# EAGLE design 261105902xxxx-HW-V2.1_20230207 (EAGLE 7.7.0)
Assembly variants: Thetis-I, Setebos-I, Proteus-III
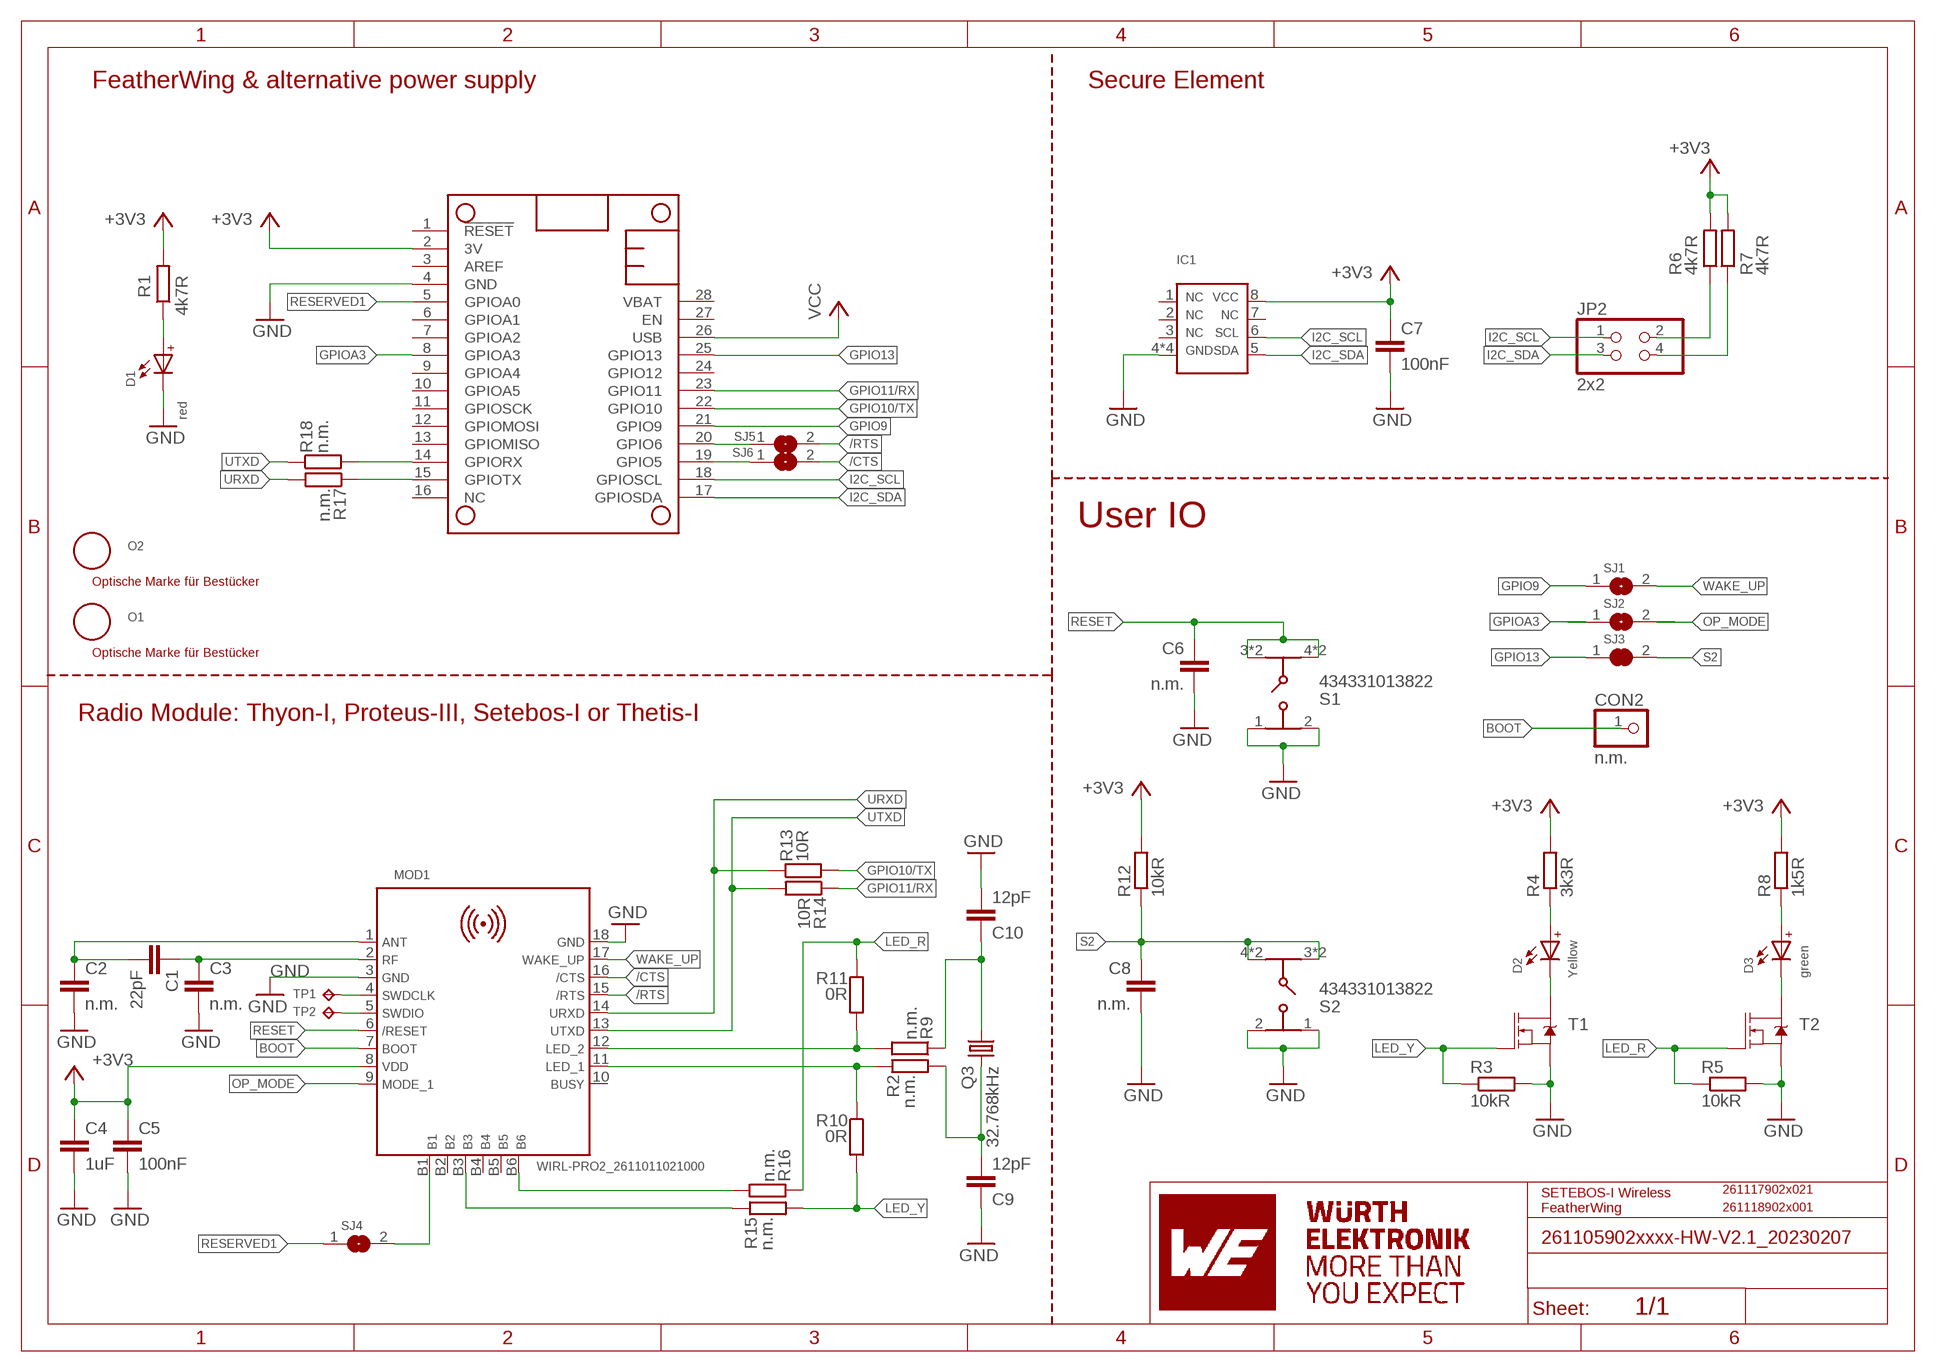
[diagram p0: schematic, sheet 1]

## Parts
C1  22pF  C22PF0402_IPC  [C0402_IPC]
C2  n.m.  C0402_IPC  [C0402_IPC]
C3  n.m.  C0402_IPC  [C0402_IPC]
C4  1uF  C1UF0402_IPC  [C0402_IPC]
C5  100nF  C100NF0402_IPC  [C0402_IPC]
C6  n.m.  C0402_IPC  [C0402_IPC]
C7  100nF  C100NF0402_IPC  [C0402_IPC]  (not fitted in variant Proteus-III)
C8  n.m.  C0402_IPC  [C0402_IPC]
C9  12pF  C12PF0402_IPC  [C0402_IPC]  (not fitted in variant Setebos-I)  (not fitted in variant Proteus-III)
C10  12pF  C12PF0402_IPC  [C0402_IPC]  (not fitted in variant Setebos-I)  (not fitted in variant Proteus-III)
CON2  n.m.  PINHD-1X1/R  [1X01/R]
D1  red  WL-SMSW_1204_155124VS73200  [WL-SMSW_1204_A]
D2  Yellow  WL-SMSW_1204_155124YS73200  [WL-SMSW_1204_A]
D3  green  WL-SMSW_1204_155124VS73200  [WL-SMSW_1204_A]
IC1  ATECC608B  ATECC608B-TNGTLS  [UDFN-8]  (not fitted in variant Proteus-III)
JP2  2x2  PINHD-2X2  [2X02]
MOD1  WIRL-PRO2_2611011021000  [WIRL-PRO2_2611011021000]
MS1  header: 1 x 12 & 1 x 16  FEATHERWING  [FEATHERWING]
O1  n.m.  OPT_MARKE  [OPTISCHE_MARKE]
O2  n.m.  OPT_MARKE  [OPTISCHE_MARKE]
Q3  32.768kHz  3216  [3216]  (not fitted in variant Setebos-I)  (not fitted in variant Proteus-III)
R1  4k7R  R4K70402_IPC  [R0402_IPC]
R2  n.m.  R0402_IPC  [R0402_IPC]  (not fitted in variant Setebos-I)  (variant Thetis-I: 0R)  (not fitted in variant Proteus-III)
R3  10kR  R10KR0402_IPC  [R0402_IPC]
R4  3k3R  R3K3R0402_IPC  [R0402_IPC]
R5  10kR  R10KR0402_IPC  [R0402_IPC]
R6  4k7R  R4K70402_IPC  [R0402_IPC]
R7  4k7R  R4K70402_IPC  [R0402_IPC]
R8  1k5R  R1K5R0402_IPC  [R0402_IPC]
R9  n.m.  R0402_IPC  [R0402_IPC]  (not fitted in variant Setebos-I)  (variant Thetis-I: 0R)  (not fitted in variant Proteus-III)
R10  0R  R0R0402_IPC  [R0402_IPC]  (not fitted in variant Thetis-I)
R11  0R  R0R0402_IPC  [R0402_IPC]  (not fitted in variant Thetis-I)
R12  10kR  R10KR0402_IPC  [R0402_IPC]
R13  10R  R10R0402_IPC  [R0402_IPC]
R14  10R  R10R0402_IPC  [R0402_IPC]
R15  n.m.  R0402_IPC  [R0402_IPC]  (variant Thetis-I: 0R)  (not fitted in variant Setebos-I)  (not fitted in variant Proteus-III)
R16  n.m.  R0402_IPC  [R0402_IPC]  (variant Thetis-I: 0R)  (not fitted in variant Setebos-I)  (not fitted in variant Proteus-III)
R17  n.m.  R0402_IPC  [R0402_IPC]
R18  n.m.  R0402_IPC  [R0402_IPC]
S1  434331013822  [434331013822]
S2  434331013822  [434331013822]
SJ1  SJ  [SJ]
SJ2  SJ  [SJ]
SJ3  SJ_SHUNTD  [SJ_D]
SJ4  SJ  [SJ]
SJ5  SJ  [SJ]
SJ6  SJ  [SJ]
T1  MOSFET-NCH-BSS138  [SOT23-3]
T2  MOSFET-NCH-BSS138  [SOT23-3]
TP1  TP15R  [TP15R]
TP2  TP15R  [TP15R]

## Nets
+3V3: C4.1 C5.1 C7.1 IC1.8(VCC) MOD1.8(VDD) MS1.2(3V) R1.2 R4.2 R6.2 R7.2 R8.2 R12.2
/CTS: MOD1.16(P0.12/!CTS) SJ6.2
/RTS: MOD1.15(P0.11/!RTS) SJ5.2
ANT: C1.2 C2.1 MOD1.1(ANT_PAD)
BOOT: CON2.1 MOD1.7(P0.02/BOOT)
GND: C2.2 C3.2 C4.2 C5.2 C6.2 C7.2 C8.2 C9.1 C10.2 D1.1(-) IC1.4(GND) IC1.P$1(GND) IC1.P$2(GND) IC1.THERMAL_PAD(GND) MOD1.3(GND) MOD1.18(GND) MS1.4(GND) R3.2 R5.2 S1.1 S1.2 S2.1 S2.2 T1.2(S) T2.2(S)
GPIO9: MS1.21(GPIO9) SJ1.1
GPIO10/TX: MS1.22(GPIO10) R13.2
GPIO11/RX: MS1.23(GPIO11) R14.1
GPIO13: MS1.25(GPIO13) SJ3.1
GPIOA3: MS1.8(GPIOA3) SJ2.1
I2C_SCL: IC1.6(SCL) JP2.1 MS1.18(GPIOSCL)
I2C_SDA: IC1.5(SDA) JP2.3 MS1.17(GPIOSDA)
LED_R: R5.1 R11.1 R16.1 T2.1(G)
LED_Y: R3.1 R10.2 R15.2 T1.1(G)
N$1: D1.2(+) R1.1
N$2: D2.2(+) R4.1
N$3: D2.1(-) T1.3(D)
N$4: D3.2(+) R8.1
N$5: D3.1(-) T2.3(D)
N$6: JP2.2 R6.1
N$7: JP2.4 R7.1
N$8: MOD1.B1 SJ4.2
N$9: MOD1.12(P0.01/LED_2) R9.2 R11.2
N$10: MOD1.11(P0.00/LED_1) R2.1 R10.1
N$11: C9.2 Q3.2 R2.2
N$12: C10.1 Q3.1 R9.1
N$13: MS1.20(GPIO6) SJ5.1
N$14: MS1.19(GPIO5) SJ6.1
N$15: MOD1.B3 R15.1
N$16: MOD1.B6 R16.2
N$17: MS1.14(GPIORX) R18.2
N$18: MS1.15(GPIOTX) R17.1
OP_MODE: MOD1.9(P0.19/MODE_1) SJ2.2
RESERVED1: MS1.5(GPIOA0) SJ4.1
RESET: C6.1 MOD1.6(P0.18/RESET) S1.3 S1.4 S1.5 S1.6
RF: C1.1 C3.1 MOD1.2(RF)
S2: C8.1 R12.1 S2.3 S2.4 S2.5 S2.6 SJ3.2
SWDCLK: MOD1.4(SWDCLK) TP1.P$1(TP)
SWDIO: MOD1.5(SWDIO) TP2.P$1(TP)
URXD: MOD1.14(P1.09/URXD) R13.1 R17.2
UTXD: MOD1.13(P1.08/UTXD) R14.2 R18.1
VCC: MS1.26(USB)
WAKE_UP: MOD1.17(P0.03/WAKE_UP) SJ1.2
Unconnected: IC1.1(NC1) IC1.2(NC2) IC1.3(NC3) IC1.7(NC4) MOD1.10(P0.22/BUSY) MOD1.B2 MOD1.B4 MOD1.B5 MS1.1(!RESET) MS1.3(AREF) MS1.6(GPIOA1) MS1.7(GPIOA2) MS1.9(GPIOA4) MS1.10(GPIOA5) MS1.11(GPIOSCK) MS1.12(GPIOMOSI) MS1.13(GPIOMISO) MS1.16(NC) MS1.24(GPIO12) MS1.27(EN) MS1.28(VBAT)

## Notes on the sheet
- FeatherWing & alternative power supply | Secure Element
- User IO
- Radio Module: Thyon-I, Proteus-III, Setebos-I or Thetis-I
- 261117902x021
- 261118902x001
- SETEBOS-I Wireless 
  FeatherWing

## Library data of the parts
C1 = rcl-WE:C; HEIGHT: 0.5mm; MANUFACTURER: Würth Elektronik; NR: 885012005057; PACK: 0402; SPG: 50V; TOL: 5%
C2 C3 C6 C8 = rcl-WE:C; HEIGHT: 0.5mm; MANUFACTURER: Würth Elektronik; PACK: 0402
C4 = rcl-WE:C; HEIGHT: 0.5mm; MANUFACTURER: Würth Elektronik; NR: 885012105012; PACK: 0402; SPG: 10V; TOL: 20%
C5 C7 = rcl-WE:C; HEIGHT: 0.5mm; MANUFACTURER: Würth Elektronik; NR: 885012205037; PACK: 0402; SPG: 16V; TOL: 10%
C9 C10 = rcl-amber:C; HEIGHT: 0.5mm; MANUFACTURER: Yageo; MAT: COG; NR: CC0402JRNP09BN120; PACK: 0402; SPG: 50V; TOL: 5%
CON2 = pinhead:PINHD-1X1: PIN HEADER
D1 = 155124VS73200_Eagle_WL-SMSW_rev19a:WL-SMSW_1204: SMD Side view mono-color round Characteristics Low power consumption High reliability Low current requirement No UV/IR radiation Wide viewing angle Excelllent for edge lighting displays and backlighting indicators Ideal for miniature applications PBC high-usage Compatible with automatic placement equipment Applications Backlighting for LCD Sidelighting applications Indicator and backlighting for telecommunication Backlighting for symbol, switch and dashboard General use <http://katalog.we-online.de/media/images/v2/Family_WL-SMSW(2).jpg> Details see: http://katalog.we-online.de/en/led/WL-SMSW?m Updated: 2015-04-10 2015 (C) Wurth Elektronik; HEIGHT: 1.5mm; MANUFACTURER: Würth Elektronik; NR: 155124RS73200; PACK: 1204
D2 = 155124VS73200_Eagle_WL-SMSW_rev19a:WL-SMSW_1204: SMD Side view mono-color round Characteristics Low power consumption High reliability Low current requirement No UV/IR radiation Wide viewing angle Excelllent for edge lighting displays and backlighting indicators Ideal for miniature applications PBC high-usage Compatible with automatic placement equipment Applications Backlighting for LCD Sidelighting applications Indicator and backlighting for telecommunication Backlighting for symbol, switch and dashboard General use <http://katalog.we-online.de/media/images/v2/Family_WL-SMSW(2).jpg> Details see: http://katalog.we-online.de/en/led/WL-SMSW?m Updated: 2015-04-10 2015 (C) Wurth Elektronik; HEIGHT: 1.5mm; MANUFACTURER: Würth Elektronik; NR: 155124YS73200; PACK: 1204
D3 = 155124VS73200_Eagle_WL-SMSW_rev19a:WL-SMSW_1204: SMD Side view mono-color round Characteristics Low power consumption High reliability Low current requirement No UV/IR radiation Wide viewing angle Excelllent for edge lighting displays and backlighting indicators Ideal for miniature applications PBC high-usage Compatible with automatic placement equipment Applications Backlighting for LCD Sidelighting applications Indicator and backlighting for telecommunication Backlighting for symbol, switch and dashboard General use <http://katalog.we-online.de/media/images/v2/Family_WL-SMSW(2).jpg> Details see: http://katalog.we-online.de/en/led/WL-SMSW?m Updated: 2015-04-10 2015 (C) Wurth Elektronik; HEIGHT: 1.5mm; MANUFACTURER: Würth Elektronik; NR: 155124VS73200; PACK: 1204
IC1 = microchip:ATECC608B-TNGTLS: CryptoAuthentication - Trust&GO secure element; HEIGHT: 0.55mm; MANUFACTURER: microchip; NR: ATECC608B-TNGTLSU; PACK: UDFN-8
JP2 = pinhead:PINHD-2X2: PIN HEADER; HEIGHT: 8.54mm; MANUFACTURER: Würth Elektronik; NR: 61300421121
MOD1 = WE_WIRL_Rev2:WIRL-PRO2_2611011021000: Thyone-I - Radio Modules 2.4 GHz WIRL-PRO2 Radio module 2.4 GHz T&R Details see: https://katalog.we-online.com/en/wco/WIRL-PRO2; HEIGHT: 2mm; MANUFACTURER: Würth Elektronik; NR: 2611011021000
MS1 = adafruit:FEATHERWING; COMMENT: Kit containing 2 headers; MANUFACTURER: Adafruit; NR: 2830
O1 O2 = testpad:OPT_MARKE: Gemäß Vorgabe MEC
Q3 = crystal:3216; HEIGHT: 0.9mm; MANUFACTURER: Würth Elektronik; MANUFACTURER_2: Microcrystal; NR: 830009706; NR_2: CM7V-T1A-32.768k-9pF-20PPM-TA-QA T3
R1 R6 R7 = rcl-amber:R; HEIGHT: 0.35mm; MANUFACTURER: Yageo; NR: RC0402FR-074K7L; P: 0.063W; PACK: 0402; TOL: 1%
R2 R9 R15-R18 = rcl-amber:R; HEIGHT: 0.35mm; MANUFACTURER: Yageo; PACK: 0402
R3 R5 R12 = rcl-amber:R; HEIGHT: 0.35mm; MANUFACTURER: Yageo; NR: RC0402FR-0710KL; PACK: 0402; TOL: 1%
R4 = rcl-amber:R; HEIGHT: 0.35; MANUFACTURER: Yageo; NR: RC0402FR-073K3L; P: 0.063W; PACK: 0402; TOL: 1%
R8 = rcl-amber:R; HEIGHT: 0.35mm; MANUFACTURER: Yageo; NR: RC0402FR-071K5L; PACK: 0402; TOL: 1%
R10 R11 = rcl-amber:R; HEIGHT: 0.35mm; MANUFACTURER: Yageo; NR: RC0402FR-070RL; PACK: 0402; TOL: 5%
R13 R14 = rcl-amber:R; HEIGHT: 0.35mm; MANUFACTURER: Yageo; NR: RC0402FR-0710RL; P: 0.063W; PACK: 0402; TOL: 1%
S1 S2 = 434331013822_Eagle_WS-TASU_rev19b:434331013822: WS-TASU Side push Tact Switch, SMD version Specification Rating : 50mA, 12VDC Contact Resistance Initial: 100mΩ max. After life test:1mΩ max. Insulation Resistance: min.100MΩ at 500VDC Dielectric Strength : 250VAC for 1 minute Stroke:0.2+0.2/-0.1mm Bounce :10ms max. Material Cover : : Stainless steel Stem :PA46 UL HB. FramePA46 UL HB, color Black >Contact : Stainless Steel with Silver Tape:Polyimide tape Terminal : Copper Alloy with Silver <http://katalog.we-online.de/media/images/v2/Family_WS-TASU_434331013822_c.jpg> Details see: http://katalog.we-online.de/en/em/TASU_3_5X2_9_SMD_SIDE_PUSH/434331013822 2015 (C) Würth Elektronik; HEIGHT: 1.35mm; MANUFACTURER: Würth Elektronik; NR: 434331013822
SJ1 SJ2 SJ4-SJ6 = jumper:SJ: SMD solder JUMPER
SJ3 = jumper:SJ_SHUNT: SMD solder JUMPER
T1 T2 = SparkFun-DiscreteSemi:MOSFET-NCH: N-channel MOSFETs Voltage controlled devices that allow control of high current outputs. SparkFun Products: SparkFun OpenScale <https://www.sparkfun.com/products/13261> SparkFun Digital Sandbox <https://www.sparkfun.com/products/12651> SparkFun Monster Moto Shield <https://www.sparkfun.com/products/10182> SparkFun MOSFET Power Controller <https://www.sparkfun.com/products/11214>; COMMENT: 220mA/50V/3.5O; HEIGHT: 1mm; MANUFACTURER: Diodes Incorporated; NR: BSS138-13-F
TP1 TP2 = testpad:TP15R

## Board
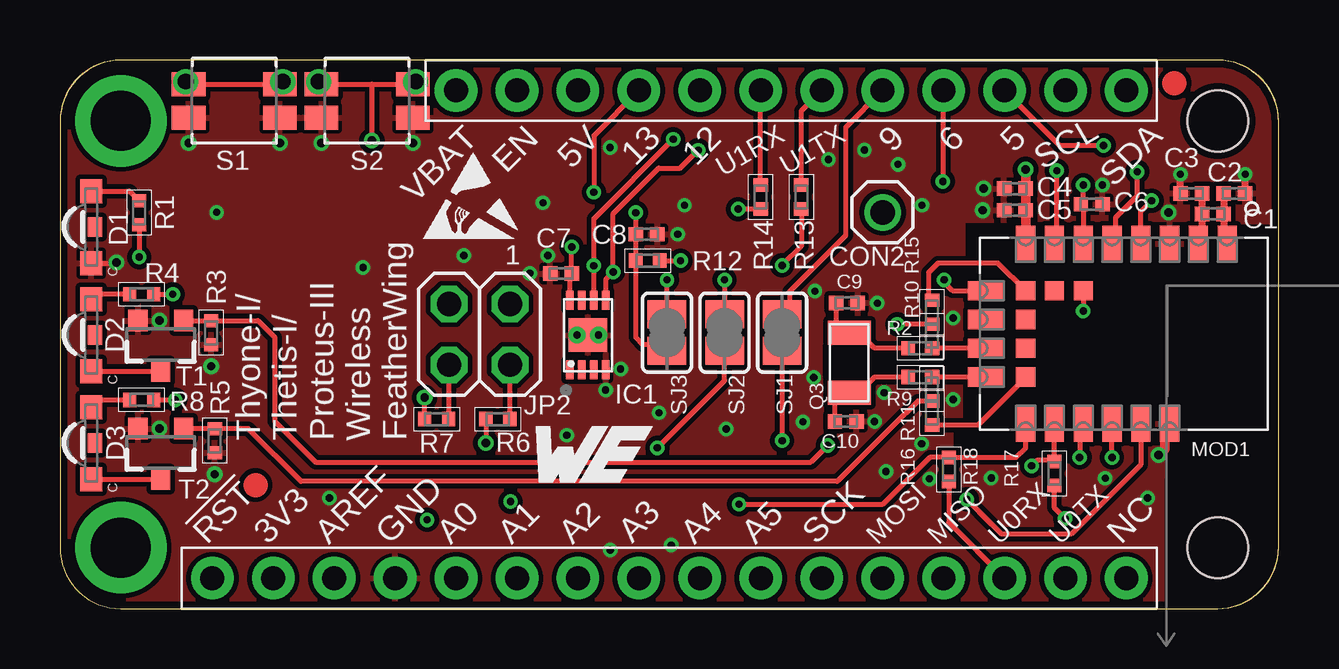
[diagram p1: board, top side]
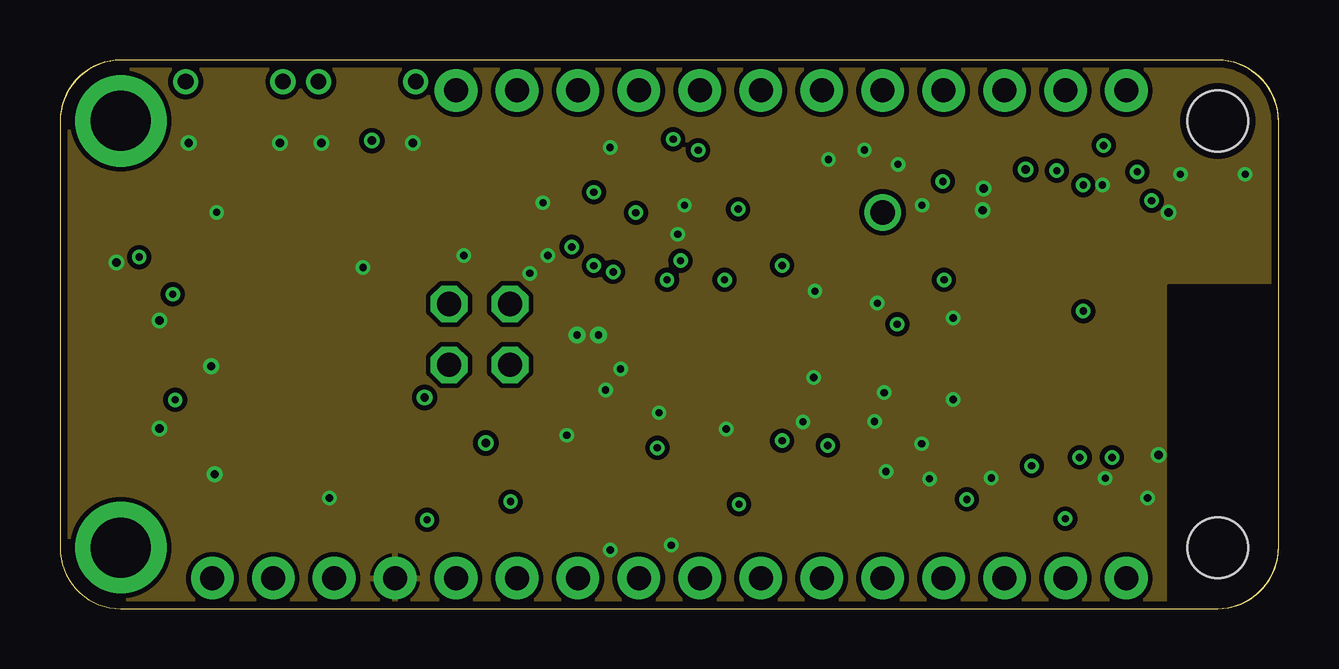
[diagram p2: board, inner layer Route2]
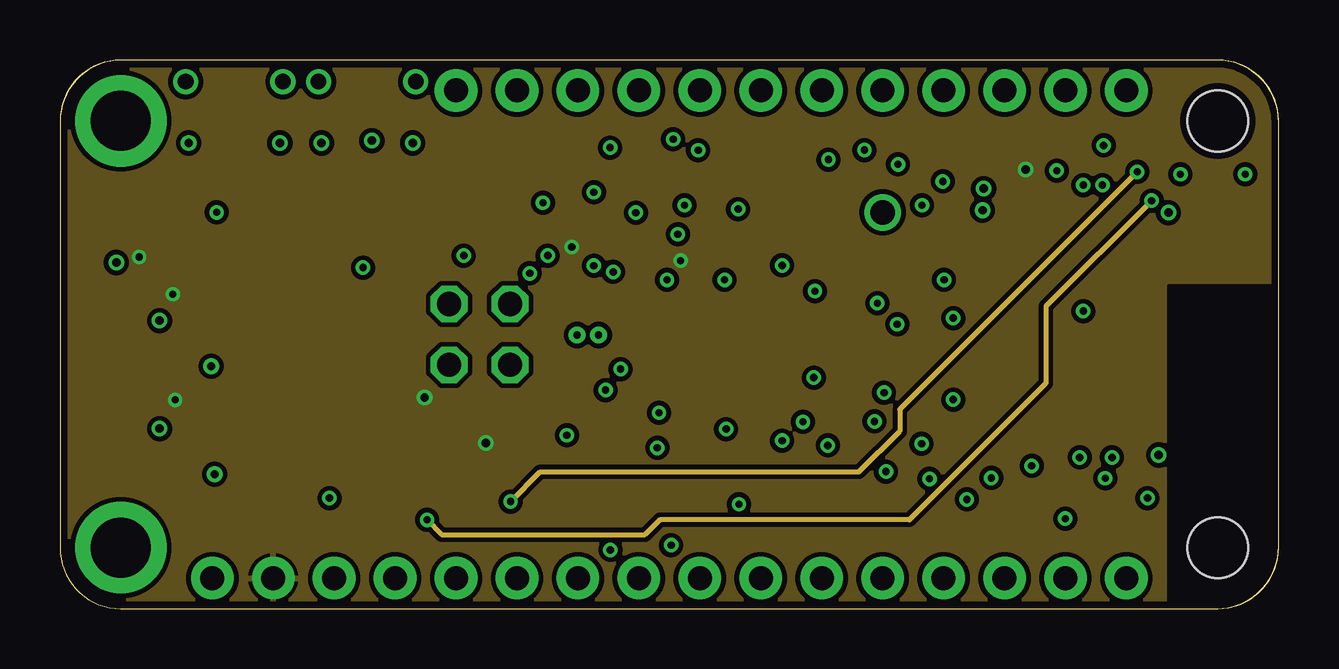
[diagram p3: board, inner layer Route15]
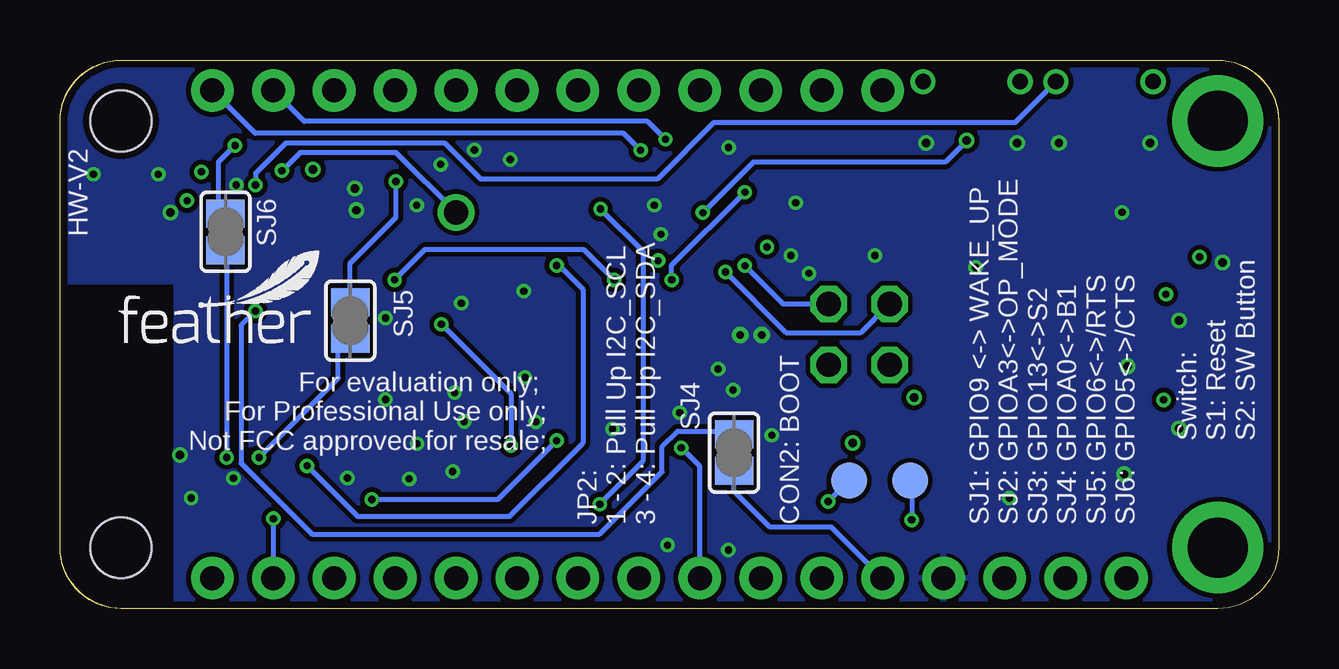
[diagram p4: board, bottom side, seen from below]

Size 50.8 x 22.86 mm. Coordinates in mm from the lower left corner, seen from the top.
Outline: 0,2.54 arc90 2.54,0 48.2,0 arc90 50.8,2.6 50.8,20.26 arc90 48.2,22.86
Outline: 2.59,22.86 arc90 0,20.27
Copper layers (1+2*15+16): Top 0.035mm / dielectric 0.412mm / Route2 0.035mm / dielectric 0.71mm / Route15 0.035mm / dielectric 0.412mm / Bottom 0.035mm
Design rules "default *": minimum track width 0.2mm, minimum drill 0.3mm, track to track 0.2mm, track to pad 0.2mm, pad to pad 0.2mm, via to via 0.2mm, smd to smd 0.2mm, copper to edge 0.3mm, drill to drill 6mil, minimum pad ring 0.2mm, minimum via ring 0.15mm, stop-mask expansion 0.05mm, vias tented up to drill 20mil, thermal gap 6mil
tRestrict: area 49.1,15.5 to 50.5,16; area 37.8,11.2 to 37.8,12.8; area 37.8,10.1 to 37.8,10.4; area 46,14.2 to 46.5,14.4; area 40.5,6.8 to 41.1,6.9; area 45.4,6.8 to 45.8,6.9; area 37.6,7.9 to 37.9,9.2; area 37.2,6.8 to 39.2,7.5; area 37.8,14.6 to 39.7,16.1; area 43,16 to 43.6,16.1; area 44.2,16 to 44.8,16.1; area 45.2,16 to 45.8,16.1; 5 more areas

### Footprints (pad centres in the part's own frame; a part is rotated, then mirrored left to right if it is on the bottom)
C0402_IPC = smd 0.6 x 0.6: 1 -0.45,0; 2 0.45,0
1X01/R = drill 1.016: 1 0,0
WL-SMSW_1204_A = smd 1 x 0.9: 1 -1.5,0; 2 1.5,0 | smd 0.8 x 0.6: 3 0,-0.15
UDFN-8 = smd 0.3 x 0.8: 1 -0.75,-1.45; 2 -0.25,-1.45; 3 0.25,-1.45; 4 0.75,-1.45; 5 0.75,1.45; 6 0.25,1.45; 7 -0.25,1.45; 8 -0.75,1.45 | drill 0.3 pad 0.7: P$1 -0.45,0; P$2 0.45,0 | smd 1.6 x 1.4: THERMAL_PAD 0,0
2X02 = drill 1.016 octagon: 1 -1.27,-1.27; 2 -1.27,1.27; 3 1.27,-1.27; 4 1.27,1.27
WIRL-PRO2_2611011021000 = smd 0.8 x 1.5: 1 -4.3,-3.75; 2 -3.1,-3.75; 3 -1.9,-3.75; 4 -0.7,-3.75; 5 0.5,-3.75; 6 1.7,-3.75; 7 2.9,-3.75; 8 4.1,-3.75; 13 4.1,3.75; 14 2.9,3.75; 15 1.7,3.75; 16 0.5,3.75; 17 -0.7,3.75; 18 -1.9,3.75 | smd 1.5 x 0.8: 9 5.75,-1.8; 10 5.75,-0.6; 11 5.75,0.6; 12 5.75,1.8 | smd 0.8 x 0.8: B1 1.7,-1.8; B2 2.9,-1.8; B3 4.1,-1.8; B4 4.1,-0.6; B5 4.1,0.6; B6 4.1,1.8
FEATHERWING = drill 1 pad 1.778: 1 6.35,1.27; 2 8.89,1.27; 3 11.43,1.27; 4 13.97,1.27; 5 16.51,1.27; 6 19.05,1.27; 7 21.59,1.27; 8 24.13,1.27; 9 26.67,1.27; 10 29.21,1.27; 11 31.75,1.27; 12 34.29,1.27; 13 36.83,1.27; 14 39.37,1.27; 15 41.91,1.27; 16 44.45,1.27; 17 44.45,21.59; 18 41.91,21.59; 19 39.37,21.59; 20 36.83,21.59; 21 34.29,21.59; 22 31.75,21.59; 23 29.21,21.59; 24 26.67,21.59; 25 24.13,21.59; 26 21.59,21.59; 27 19.05,21.59; 28 16.51,21.59 | drill 2.5 pad 3.81: P$1 2.54,20.32; P$2 2.54,2.54 | hole 2.54: 48.26,20.32; 48.26,2.54
3216 = smd 1 x 1.8: 1 1.25,0; 2 -1.25,0
R0402_IPC = smd 0.55 x 0.6: 1 -0.5,0; 2 0.5,0
434331013822 = smd 1.4 x 1: 1 -1.9,0.7; 2 1.9,0.7; 3 1.9,-0.7; 4 -1.9,-0.7 | drill 0.65 pad 0.78: 5 -2.025,-0.8; 6 2.025,-0.8
SJ = smd 1.168 x 1.6: 1 -0.762,0; 2 0.762,0
SJ_D = smd 1.168 x 1.6: 1 -0.762,0; 2 0.762,0
SOT23-3 = smd 0.8 x 0.9: 1 -0.95,-1; 2 0.95,-1; 3 0,1.1
TP15R = smd 1.5 x 1.5: P$1 0,0

### Placement (x,y rotation side)
C1  48.05,16.45 0 top
C2  48.95,17.3 0 top
C3  47.15,17.3 180 top
C4  39.8,17.5 180 top
C5  39.8,16.6 180 top
C6  43,16.85 0 top
C7  20.88,13.96 180 top
C8  24.45,15.6 0 top
C9  32.8,12.74 180 top
C10  32.75,7.8 0 top
CON2  34.29,16.51 0 top
D1  1.3,15.9 90 top
D2  1.3,11.4 90 top
D3  1.3,6.9 90 top
IC1  22,11.4 0 top
JP2  17.49,11.43 180 top
MOD1  44.35,11.45 180 top
MS1  0,0 0 top
O1  8.15,5.15 0 top
O2  46.45,21.9 0 top
Q3  32.9,10.25 270 top
R1  3.3,16.5 270 top
R2  35.85,10.85 180 top
R3  6.3,11.5 270 top
R4  3.4,13.1 0 top
R5  6.45,7 270 top
R6  18.25,7.9 180 top
R7  15.7,7.9 180 top
R8  3.4,8.7 0 top
R9  35.85,9.65 0 top
R10  36.35,11.35 90 top
R11  36.35,9.15 90 top
R12  24.5,14.5 0 top
R13  30.9,17.15 90 top
R14  29.2,17.15 270 top
R15  36.35,12.35 270 top
R16  36.35,8.15 270 top
R17  41.45,5.63 90 top
R18  37.05,5.8 270 top
S1  7.26,21.16 180 top
S2  12.8,21.16 180 top
SJ1  30.1,11.5 270 top
SJ2  27.7,11.5 90 top
SJ3  25.3,11.5 270 top
SJ4  22.7,6.5 90 bottom
SJ5  38.7,12 270 bottom
SJ6  43.9,15.7 270 bottom
T1  4.2,11 180 top
T2  4.2,6.5 180 top
TP1  15.37,5.33 0 bottom
TP2  17.91,5.33 0 bottom
U$1  [ESD_4MM]  15.15,15.4 0 top
U$2  [WE-8MM_TNAME]  19.8,5.2 0 top
U$3  [FEATHER_8MM]  48.35,11.05 0 bottom

### Tracks (layer width: path | path; a pad name or v marks a point on that pad's centre or on a via)
+3V3  (via drill 0.3, 0.35)
  Top 0.2: R8.2 v4.8,8.7 | R4.2 v4.7,13.1 | R1.2 v3.3,14.65 | R7.2 v15.2,8.8 | R6.2 v17.75,6.9 | v21.33,15.07 C7.1 21.33,13.82 21.25,13.74 IC1.8 | R12.2 v25.87,14.5
  Top 0.4: MOD1.8 C5.1 C4.1 v40.25,18.3
  pour Route15: 0,0 0,22.86 50.8,22.86 50.8,0
  cutout Route15: 46.23,13.46 46.23,-0.51 51.82,-0.51 51.82,13.46
/CTS  (via drill 0.3)
  Top 0.2: v43.85,6.3 MOD1.16
  Bottom 0.2: SJ6.2 43.85,14.89 v43.85,6.3
/RTS  (via drill 0.3)
  Top 0.2: MOD1.15 42.5,7.55 v42.5,6.3
  Bottom 0.2: v42.5,6.3 39.2,9.6 39.2,10.8 38.76,11.24 SJ5.2
ANT
  Top 0.2: 48.5,15.33 48.52,15.33 MOD1.1
  Top 0.3: C2.1 C1.2 48.5,15.33
BOOT  (via drill 0.3)
  Top 0.2: MOD1.7 41.55,15.3 v41.55,18.25
  Bottom 0.2: CON2.1 36.78,19 40.8,19 v41.55,18.25
GND  (via drill 0.3, 0.35)
  Top 0.2: 46.2,15.23 46.27,15.23 46.3,15.2 MOD1.3 | 46.05,7.48 46.05,7.5 MOD1.18 | D1.1 2.35,14.4
  Top 0.3: C3.2 v46.7,18.1 | C2.2 v49.4,18.1
  Top 0.4: 46.05,7.48 46.05,6.65 v45.8,6.4
  other vias: 46.2,16.5 43.45,17.65 38.45,16.6 38.5,17.5 5.36,19.4 9.16,19.4 10.9,19.4 14.7,19.4 20.33,14.71 25.75,15.6 6.45,5.6 4.15,7.5 4.15,12 6.3,10.1 2.35,14.42 33.95,7.8 34.07,12.73 22.74,9.11 19.58,13.97 23.37,9.98 43.57,5.43 36.24,5.41 35.91,6.87 27.77,7.48 30.97,7.78 6.53,16.51 12.63,14.21 20.13,16.91 26.03,16.81 33.53,19.11 32.03,18.71 22.93,19.21 34.93,18.51 35.93,16.81 34.43,5.71 45.33,4.61 11.23,4.61 16.83,14.71 37.23,8.71 37.23,12.11 34.35,9 31.42,9.63 31.47,13.23 25.48,2.64 22.94,2.44 21.13,7.22 24.97,8.16 38.82,5.44
  pour Bottom: 0,12.06 0,20.32 arc-90 2.54,22.86 48.26,22.86 arc-90 50.8,20.32 50.8,2.67 arc-90 48.13,0 2.41,0 arc-90 0,2.41
  pour Route2: 0,0 0,22.86 50.8,22.86 50.8,0
  cutout Route2: 46.23,13.46 46.23,-0.51 51.82,-0.51 51.82,13.46
  pour Top: 0,12.06 0,20.32 arc-90 2.54,22.86 48.26,22.86 arc-90 50.8,20.32 50.8,2.67 arc-90 48.13,0 2.41,0 arc-90 0,2.41
GPIO9
  Top 0.2: MS1.21 32.75,20.05 32.75,15.55 30.4,13.2 30.4,12.8 30.1,12.5 SJ1.1
GPIO10/TX
  Top 0.2: R13.2 30.9,20.74 MS1.22
GPIO11/RX
  Top 0.2: R14.1 MS1.23
GPIO13  (via drill 0.3)
  Top 0.2: MS1.25 22.25,19.71 v22.25,17.35 | SJ3.1 v25.3,13.7
  Bottom 0.2: v25.3,13.7 25.3,14.3 v22.25,17.35
GPIOA3  (via drill 0.3)
  Top 0.2: v24.9,6.7 27.7,9.5 SJ2.1
  Bottom 0.2: MS1.8 24.13,5.93 v24.9,6.7
I2C_SCL  (via drill 0.3)
  Top 0.2: IC1.6 | IC1.6 v22.25,14.29 22.25,16.25 v25.56,19.56
  Bottom 0.2: MS1.18 40.62,20.3 26.3,20.3 v25.56,19.56 | v22.25,14.29 20.66,12.7 JP2.1
I2C_SDA  (via drill 0.3)
  Top 0.2: v26.6,19.1 25.85,18.35 24.95,18.35 23.06,16.46 v23.06,14.03 22.75,13.72 IC1.5
  Bottom 0.2: v23.06,14.03 20.53,11.5 17.42,11.5 JP2.3 | v26.6,19.1 27.3,19.8 42.66,19.8 MS1.17
LED_R
  Top 0.2: R16.1 35.75,8.65 34.7,7.6 32.4,5.3 10.05,5.3 7.85,7.5 6.35,7.5 6.3,7.45 | 6.3,7.45 6.45,7.45 R5.1 | 6.3,7.45 6.25,7.5 T2.1
LED_Y  (via drill 0.3)
  Top 0.2: T1.1 R3.1 8.25,12 8.95,11.3 8.95,7.8 10.65,6.1 31.3,6.1 v32,6.8 | R15.2 v34.9,11.85
  Bottom 0.2: v34.9,11.85 32,8.95 v32,6.8
N$1
  Top 0.2: D1.2 2.9,17.4 R1.1
N$2
  Top 0.2: R4.1 1.5,13.1 D2.2
N$3
  Top 0.2: D2.1 T1.3
N$4
  Top 0.2: D3.2 1.6,8.7 R8.1
N$5
  Top 0.2: D3.1 T2.3
N$6
  Top 0.2: R6.1 JP2.2
N$7
  Top 0.2: R7.1 16.22,7.92 JP2.4
N$8  (via drill 0.3)
  Top 0.2: MOD1.B1 v42.65,12.4
  Bottom 0.2: v42.65,12.4 43.25,11.8 43.25,6.05 40.3,3.1 28.3,3.1 25.7,5.7 25.7,6.76 25.06,7.4 22.84,7.4 SJ4.2
N$9
  Top 0.2: MOD1.12 R11.2
N$10
  Top 0.2: MOD1.11 R2.1
N$11
  Top 0.2: C9.2 32.35,11.5 Q3.2 33.3,11.5 33.95,10.85 R2.2
N$12
  Top 0.2: C10.1 32.3,8.75 32.55,9 Q3.1 33.3,9 33.95,9.65 R9.1
N$13  (via drill 0.3)
  Top 0.2: v36.8,17.8 36.83,17.83 MS1.20
  Bottom 0.2: SJ5.1 38.7,14.4 36.8,16.3 v36.8,17.8
N$14  (via drill 0.3)
  Top 0.2: MS1.19 41.66,19.3 v43.5,19.3
  Bottom 0.2: v43.5,19.3 44.2,18.6 44.2,16.9 43.9,16.6 SJ6.1
N$15
  Top 0.2: MOD1.B3 39.1,14.4 36.6,14.4 36.2,14 36.2,12.85 R15.1
N$16
  Top 0.2: MOD1.B6 38.25,7.65 R16.2
N$17
  Top 0.2: R18.2 37.05,3.59 MS1.14
N$18  (via drill 0.3)
  Top 0.2: R17.1 41.45,4.2 v41.9,3.75
  Bottom 0.2: MS1.15 v41.91,3.74 v41.9,3.75
OP_MODE  (via drill 0.3)
  Top 0.2: v36.85,13.7 36.85,13.6 37.2,13.25 MOD1.9 | v27.7,13.7 SJ2.2
  Bottom 0.2: v36.85,13.7 35.58,14.97 28.97,14.97 v27.7,13.7
RESERVED1
  Bottom 0.2: MS1.5 18.64,3.4 21.2,3.4 22.7,4.9 SJ4.1
RESET  (via drill 0.3)
  Top 0.2: S1.5 9.26,21.96 S1.4 S1.3 5.26,21.96 S1.6 | MOD1.6 42.65,16.75 C6.1 42.65,16.95 v42.65,17.65
  Bottom 0.2: S1.5 11,20.25 23.55,20.25 25.9,17.9 33.25,17.9 34.75,19.4 41.4,19.4 42.65,18.15 v42.65,17.65
RF
  Top 0.2: MOD1.2 47.47,15.2 47.6,15.33
  Top 0.3: C3.1 C1.1 47.6,15.33
S2  (via drill 0.3, 0.35)
  Top 0.2: v24,16.5 C8.1 R12.1 24,11.3 24.3,11 25.04,11 SJ3.2 | S2.6 10.8,21.96 S2.3 13,21.86 | 13,21.86 S2.4 14.73,21.86 S2.5 | v13,19.5 13,21.86
  Bottom 0.2: v13,19.5 13.9,18.6 21.9,18.6 v24,16.5
SWDCLK  (via drill 0.3)
  Top 0.2: 45.2,15.35 MOD1.4 45.05,16.55 v45.5,17
  Route15 0.2: v15.3,3.7 15.92,3.08 24.38,3.08 25,3.7 35.4,3.7 41.1,9.4 41.1,12.6 v45.5,17
  Bottom 0.2: TP1.P$1 15.3,5.27 v15.3,3.7
SWDIO  (via drill 0.3)
  Top 0.2: 43.85,15.65 MOD1.5 44,15.35 44,16.3 44.9,17.2 v44.9,18.2
  Route15 0.2: v44.9,18.2 35,8.3 35,7.4 33.3,5.7 20.02,5.7 v18.78,4.46
  Bottom 0.2: v18.78,4.46 TP2.P$1
URXD  (via drill 0.3)
  Top 0.2: v40.5,5.95 40.75,6.2 41.38,6.2 | 41.38,6.2 R17.2 | 41.38,6.2 41.45,6.27 MOD1.14 | R13.1 30.9,15.1 v30.1,14.3
  Bottom 0.2: 32.8,3.85 | 32.8,3.85 38.4,3.85 v40.5,5.95 | 32.8,3.85 32.05,3.85 29,6.9 29,13.3 30,14.3 v30.1,14.3
UTXD  (via drill 0.3)
  Top 0.2: MOD1.13 40.25,6.7 39.85,6.3 R18.1 36.25,6.3 34.3,4.35 v28.3,4.35 | R14.2 v28.27,16.65
  Bottom 0.2: v28.3,4.35 26.5,6.15 26.5,14.88 v28.27,16.65
WAKE_UP  (via drill 0.3)
  Top 0.2: MOD1.17 45.05,6 42.15,3.1 39.25,3.1 v37.8,4.55 38.85,3.5 | SJ1.2 v30.1,7
  Bottom 0.2: v37.8,4.55 32.55,4.55 v30.1,7

### Text on the board
tNames: SCL | VBAT | EN | 5V | 13 | 12 | U1RX | U1TX | 9 | 6 | 5 | SDA | 1 | Thyone-I/ / Thetis-I/ / Proteus-III / Wireless / FeatherWing | !RST | 3V3 | AREF | GND | A0 | A1 | A2 | A3 | A4 | A5 | SCK | MOSI | MISO | U0RX | U0TX | NC
bNames: HW-V2 | For evaluation only; / For Professional Use only; / Not FCC approved for resale; | Switch: / S1: Reset / S2: SW Button | SJ1: GPIO9 <-> WAKE_UP / SJ2: GPIOA3<->OP_MODE / SJ3: GPIO13<->S2 / SJ4: GPIOA0<->B1 / SJ5: GPIO6<->/RTS / SJ6: GPIO5<->/CTS | CON2: BOOT | JP2: / 1 - 2: Pull Up I2C_SCL / 3 - 4: Pull Up I2C_SDA